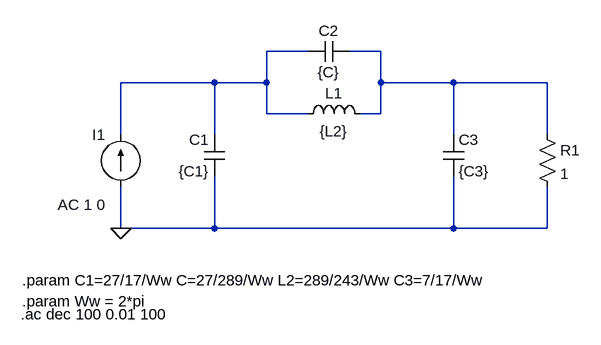
[diagram p0: schematic TS12_E2.asc]
TS12_E2.asc, the LTspice schematic file:
Version 4
SHEET 1 880 680
WIRE 240 64 176 64
WIRE 352 64 304 64
WIRE 96 112 -48 112
WIRE 176 112 176 64
WIRE 176 112 96 112
WIRE 352 112 352 64
WIRE 464 112 352 112
WIRE 608 112 464 112
WIRE 176 160 176 112
WIRE 240 160 176 160
WIRE 352 160 352 112
WIRE 352 160 320 160
WIRE -48 192 -48 112
WIRE 96 192 96 112
WIRE 464 192 464 112
WIRE 608 192 608 112
WIRE -48 336 -48 272
WIRE 96 336 96 256
WIRE 96 336 -48 336
WIRE 464 336 464 256
WIRE 464 336 96 336
WIRE 608 336 608 272
WIRE 608 336 464 336
FLAG -48 336 0
SYMBOL cap 112 256 R180
WINDOW 0 24 56 Left 2
WINDOW 3 24 8 Left 2
SYMATTR InstName C1
SYMATTR Value {C1}
SYMBOL cap 304 48 R90
WINDOW 0 0 32 VBottom 2
WINDOW 3 32 32 VTop 2
SYMATTR InstName C2
SYMATTR Value {C}
SYMBOL cap 448 192 R0
SYMATTR InstName C3
SYMATTR Value {C3}
SYMBOL ind 224 176 R270
WINDOW 0 32 56 VTop 2
WINDOW 3 5 56 VBottom 2
SYMATTR InstName L1
SYMATTR Value {L2}
SYMBOL res 592 176 R0
SYMATTR InstName R1
SYMATTR Value 1
SYMBOL current -48 272 R180
WINDOW 0 24 80 Left 2
WINDOW 3 24 0 Left 2
WINDOW 123 24 -28 Left 2
WINDOW 39 0 0 Left 0
SYMATTR InstName I1
SYMATTR Value ""
SYMATTR Value2 AC 1 0
TEXT -200 416 Left 2 !.param C1=27/17/Ww C=27/289/Ww L2=289/243/Ww C3=7/17/Ww
TEXT -200 448 Left 2 !.param Ww = 2*pi
TEXT -202 468 Left 2 !.ac dec 100 0.01 100

The netlist it stands for:
* TS12_E2.asc
C1 0 N001 {C1}
C2 N002 N001 {C}
C3 N002 0 {C3}
L1 N001 N002 {L2}
R1 N002 0 1
I1 0 N001 AC 1 0
.param C1=27/17/Ww C=27/289/Ww L2=289/243/Ww C3=7/17/Ww
.param Ww = 2*pi
.ac dec 100 0.01 100
.backanno
.end